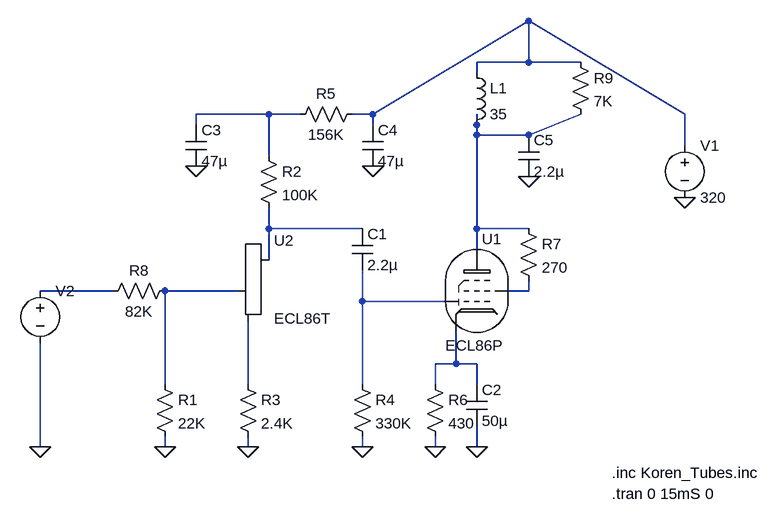
[diagram p0: schematic lambo-1-audio.asc]
lambo-1-audio.asc, the LTspice schematic file:
Version 4
SHEET 1 908 680
WIRE 496 -48 496 -112
WIRE 496 -48 416 -48
WIRE 576 -48 496 -48
WIRE 416 -32 416 -48
WIRE 96 32 -16 32
WIRE 144 32 96 32
WIRE 256 32 496 -112
WIRE 256 32 224 32
WIRE 736 32 496 -112
WIRE -16 48 -16 32
WIRE 256 48 256 32
WIRE 416 48 416 32
WIRE 416 64 416 48
WIRE 496 64 576 32
WIRE 496 64 416 64
WIRE 736 80 736 32
WIRE 96 96 96 32
WIRE 96 208 96 176
WIRE 240 208 96 208
WIRE 416 208 416 64
WIRE 496 208 416 208
WIRE 416 240 416 208
WIRE 96 256 96 208
WIRE -144 304 -256 304
WIRE 48 304 -64 304
WIRE 496 304 496 288
WIRE 496 304 464 304
WIRE 240 320 240 272
WIRE 368 320 240 320
WIRE 384 416 384 368
WIRE 384 416 352 416
WIRE 416 416 384 416
WIRE -64 448 -64 304
WIRE 64 448 64 352
WIRE 240 448 240 320
WIRE 352 448 352 416
WIRE 416 448 416 416
WIRE -256 544 -256 384
WIRE -64 544 -64 528
WIRE 64 544 64 528
WIRE 240 544 240 528
WIRE 352 544 352 528
WIRE 416 544 416 512
FLAG 736 160 0
FLAG 416 544 0
FLAG 352 544 0
FLAG 240 544 0
FLAG 64 544 0
FLAG -64 544 0
FLAG -256 544 0
FLAG 256 112 0
FLAG -16 112 0
FLAG 496 128 0
SYMBOL Misc/triode 96 304 R0
SYMATTR InstName U2
SYMATTR Value ECL86T
SYMBOL voltage 736 64 R0
SYMATTR InstName V1
SYMATTR Value 320
SYMBOL voltage -256 288 R0
WINDOW 3 24 38 Invisible 2
WINDOW 123 0 0 Left 2
WINDOW 39 0 0 Left 2
SYMATTR Value SINE(0 1 1000)
SYMATTR InstName V2
SYMBOL cap 224 208 R0
SYMATTR InstName C1
SYMATTR Value 2.2µ
SYMBOL cap 400 448 R0
SYMATTR InstName C2
SYMATTR Value 50µ
SYMBOL res 48 432 R0
SYMATTR InstName R3
SYMATTR Value 2.4K
SYMBOL res 336 432 R0
SYMATTR InstName R6
SYMATTR Value 430
SYMBOL res -80 432 R0
SYMATTR InstName R1
SYMATTR Value 22K
SYMBOL res 224 432 R0
SYMATTR InstName R4
SYMATTR Value 330K
SYMBOL res 80 80 R0
SYMATTR InstName R2
SYMATTR Value 100K
SYMBOL res 480 192 R0
SYMATTR InstName R7
SYMATTR Value 270
SYMBOL pentode-ECL86 416 304 R0
SYMATTR InstName U1
SYMATTR Value ECL86P
SYMBOL res 128 48 R270
WINDOW 0 32 56 VTop 2
WINDOW 3 0 56 VBottom 2
SYMATTR InstName R5
SYMATTR Value 156K
SYMBOL cap -32 48 R0
SYMATTR InstName C3
SYMATTR Value 47µ
SYMBOL cap 240 48 R0
SYMATTR InstName C4
SYMATTR Value 47µ
SYMBOL res -48 288 R90
WINDOW 0 0 56 VBottom 2
WINDOW 3 32 56 VTop 2
SYMATTR InstName R8
SYMATTR Value 82K
SYMBOL ind 400 -48 R0
SYMATTR InstName L1
SYMATTR Value 35
SYMATTR SpiceLine Rser=1
SYMBOL res 560 -64 R0
SYMATTR InstName R9
SYMATTR Value 7K
SYMBOL cap 480 64 R0
SYMATTR InstName C5
SYMATTR Value 2.2µ
TEXT 624 584 Left 2 !.inc Koren_Tubes.inc
TEXT 624 616 Left 2 !.tran 0 15mS 0

The netlist it stands for:
* lambo-1-audio.asc
XU2 N004 N006 N010 ECL86T
V1 N001 0 320
V2 N005 0 SINE(0 1 1000)
C1 N004 N008 2.2µ
C2 N009 0 50µ
R3 N010 0 2.4K
R6 N009 0 430
R1 N006 0 22K
R4 N008 0 330K
R2 N002 N004 100K
R7 N003 N007 270
XU1 N003 N007 N008 N009 ECL86P  ; pins Anode G2 G1 Cathode
R5 N002 N001 156K
C3 N002 0 47µ
C4 N001 0 47µ
R8 N006 N005 82K
L1 N001 N003 35 Rser=1
R9 N001 N003 7K
C5 N003 0 2.2µ
.inc Koren_Tubes.inc
.tran 0 15mS 0
.backanno
.end